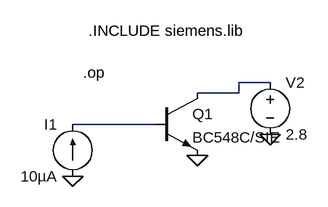
[diagram p0: schematic tbjsiemenshfe.asc]
tbjsiemenshfe.asc, the LTspice schematic file:
Version 4
SHEET 1 880 680
WIRE 320 96 272 96
WIRE 272 112 272 96
WIRE 272 112 208 112
WIRE 144 160 16 160
FLAG 208 208 0
FLAG 320 176 0
FLAG 16 240 0
SYMBOL voltage 320 80 R0
WINDOW 123 0 0 Left 2
WINDOW 39 0 0 Left 2
SYMATTR InstName V2
SYMATTR Value 2.8
SYMBOL npn 144 112 R0
SYMATTR InstName Q1
SYMATTR Value BC548C/SIE
SYMBOL current 16 240 R180
WINDOW 0 24 80 Left 2
WINDOW 3 24 0 Left 2
SYMATTR InstName I1
SYMATTR Value 10µA
TEXT 40 16 Left 2 !.INCLUDE siemens.lib
TEXT 32 80 Left 2 !.op

The netlist it stands for:
* tbjsiemenshfe.asc
V2 N001 0 2.8
Q1 N001 N002 0 0 BC548C/SIE
I1 0 N002 10µA
.model NPN NPN
.model PNP PNP
.lib standard.bjt
.INCLUDE siemens.lib
.op
.backanno
.end